# Altium project newUA_6.PrjPcb
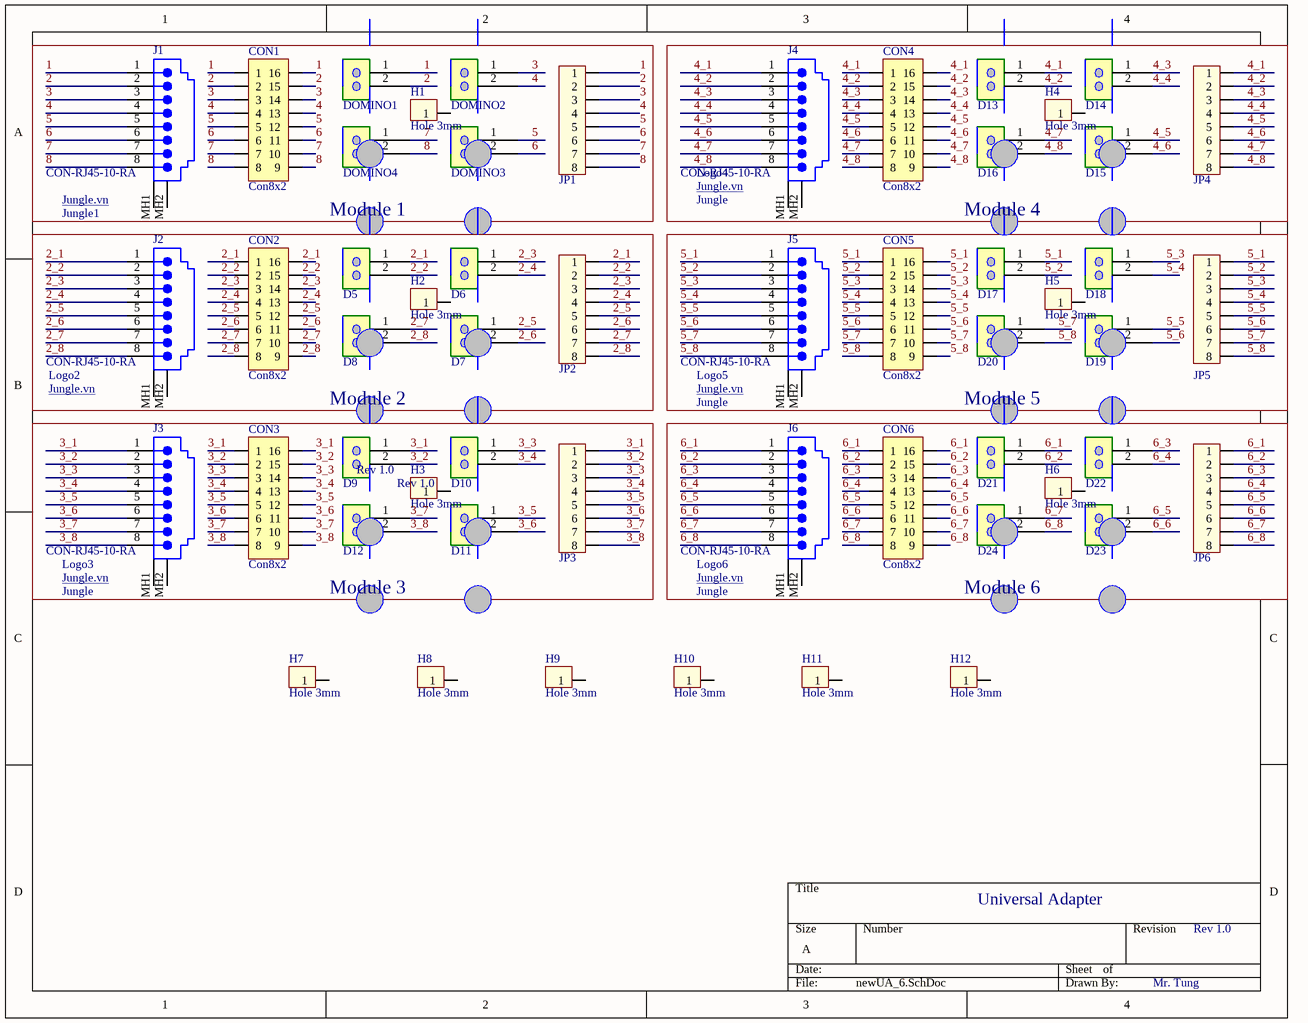
[diagram p0: newUA_6.SchDoc]
1 sheet, 60 parts. Net scope: global (net labels, ports and power ports of the same name join across sheets).
Board file: newUA_6.PcbDoc

## Sheet newUA_6.SchDoc: Universal Adapter
size A; DrawnBy: Mr. Tung; Revision: Rev 1.0

### Parts
CON1  Con8x2  [HEAD8x2]
CON2  Con8x2  [HEAD8x2]
CON3  Con8x2  [HEAD8x2]
CON4  Con8x2  [HEAD8x2]
CON5  Con8x2  [HEAD8x2]
CON6  Con8x2  [HEAD8x2]
D1  DOMINO1  [Domino2_small]
D2  DOMINO2  [Domino2_small]
D3  DOMINO3  [Domino2_small]
D4  DOMINO4  [Domino2_small]
D5  D5  [Domino2_small]
D6  D6  [Domino2_small]
D7  D7  [Domino2_small]
D8  D8  [Domino2_small]
D9  D9  [Domino2_small]
D10  D10  [Domino2_small]
D11  D11  [Domino2_small]
D12  D12  [Domino2_small]
D13  D13  [Domino2_small]
D14  D14  [Domino2_small]
D15  D15  [Domino2_small]
D16  D16  [Domino2_small]
D17  D17  [Domino2_small]
D18  D18  [Domino2_small]
D19  D19  [Domino2_small]
D20  D20  [Domino2_small]
D21  D21  [Domino2_small]
D22  D22  [Domino2_small]
D23  D23  [Domino2_small]
D24  D24  [Domino2_small]
H1  Hole 3mm  [Hole_3mm]
H2  Hole 3mm  [Hole_3mm]
H3  Hole 3mm  [Hole_3mm]
H4  Hole 3mm  [Hole_3mm]
H5  Hole 3mm  [Hole_3mm]
H6  Hole 3mm  [Hole_3mm]
H7  Hole 3mm  [Hole_3mm]
H8  Hole 3mm  [Hole_3mm]
H9  Hole 3mm  [Hole_3mm]
H10  Hole 3mm  [Hole_3mm]
H11  Hole 3mm  [Hole_3mm]
H12  Hole 3mm  [Hole_3mm]
J1  CON-RJ45-10-RA  [RJ45_tme]
J2  CON-RJ45-10-RA  [RJ45_tme]
J3  CON-RJ45-10-RA  [RJ45_tme]
J4  CON-RJ45-10-RA  [RJ45_tme]
J5  CON-RJ45-10-RA  [RJ45_tme]
J6  CON-RJ45-10-RA  [RJ45_tme]
JP1  JP8  [CON8mod]  (value not drawn)
JP2  JP8  [CON8mod]  (value not drawn)
JP3  JP8  [CON8mod]  (value not drawn)
JP4  JP8  [CON8mod]  (value not drawn)
JP5  JP8  [CON8mod]  (value not drawn)
JP6  JP8  [CON8mod]  (value not drawn)
Logo1  Jungle1  [Jungle]
Logo2  Jungle2  [Jungle]  (value not drawn)
Logo3  Jungle  [Jungle]
Logo4  Jungle  [Jungle]
Logo5  Jungle  [Jungle]
Logo6  Jungle  [Jungle]

### Blocks framed on the sheet
Module 1: CON1 D1-D4 H1 J1 JP1 Logo1
Module 4: CON4 D13-D16 H4 J4 JP4 Logo4
Module 2: CON2 D5-D8 H2 J2 JP2 Logo2
Module 3: CON3 D9-D12 H3 J3 JP3 Logo3

### Nets
1: CON1.1 CON1.16 D1.1 J1.1 JP1.1
2: CON1.2 CON1.15 D1.2 J1.2 JP1.2
2_1: CON2.1 CON2.16 D5.1 J2.1 JP2.1
2_2: CON2.2 CON2.15 D5.2 J2.2 JP2.2
2_3: CON2.3 CON2.14 D6.1 J2.3 JP2.3
2_4: CON2.4 CON2.13 D6.2 J2.4 JP2.4
2_5: CON2.5 CON2.12 D7.1 J2.5 JP2.5
2_6: CON2.6 CON2.11 D7.2 J2.6 JP2.6
2_7: CON2.7 CON2.10 D8.1 J2.7 JP2.7
2_8: CON2.8 CON2.9 D8.2 J2.8 JP2.8
3: CON1.3 CON1.14 D2.1 J1.3 JP1.3
3_1: CON3.1 CON3.16 D9.1 J3.1 JP3.1
3_2: CON3.2 CON3.15 D9.2 J3.2 JP3.2
3_3: CON3.3 CON3.14 D10.1 J3.3 JP3.3
3_4: CON3.4 CON3.13 D10.2 J3.4 JP3.4
3_5: CON3.5 CON3.12 D11.1 J3.5 JP3.5
3_6: CON3.6 CON3.11 D11.2 J3.6 JP3.6
3_7: CON3.7 CON3.10 D12.1 J3.7 JP3.7
3_8: CON3.8 CON3.9 D12.2 J3.8 JP3.8
4: CON1.4 CON1.13 D2.2 J1.4 JP1.4
4_1: CON4.1 CON4.16 D13.1 J4.1 JP4.1
4_2: CON4.2 CON4.15 D13.2 J4.2 JP4.2
4_3: CON4.3 CON4.14 D14.1 J4.3 JP4.3
4_4: CON4.4 CON4.13 D14.2 J4.4 JP4.4
4_5: CON4.5 CON4.12 D15.1 J4.5 JP4.5
4_6: CON4.6 CON4.11 D15.2 J4.6 JP4.6
4_7: CON4.7 CON4.10 D16.1 J4.7 JP4.7
4_8: CON4.8 CON4.9 D16.2 J4.8 JP4.8
5: CON1.5 CON1.12 D3.1 J1.5 JP1.5
5_1: CON5.1 CON5.16 D17.1 J5.1 JP5.1
5_2: CON5.2 CON5.15 D17.2 J5.2 JP5.2
5_3: CON5.3 CON5.14 D18.1 J5.3 JP5.3
5_4: CON5.4 CON5.13 D18.2 J5.4 JP5.4
5_5: CON5.5 CON5.12 D19.1 J5.5 JP5.5
5_6: CON5.6 CON5.11 D19.2 J5.6 JP5.6
5_7: CON5.7 CON5.10 D20.1 J5.7 JP5.7
5_8: CON5.8 CON5.9 D20.2 J5.8 JP5.8
6: CON1.6 CON1.11 D3.2 J1.6 JP1.6
6_1: CON6.1 CON6.16 D21.1 J6.1 JP6.1
6_2: CON6.2 CON6.15 D21.2 J6.2 JP6.2
6_3: CON6.3 CON6.14 D22.1 J6.3 JP6.3
6_4: CON6.4 CON6.13 D22.2 J6.4 JP6.4
6_5: CON6.5 CON6.12 D23.1 J6.5 JP6.5
6_6: CON6.6 CON6.11 D23.2 J6.6 JP6.6
6_7: CON6.7 CON6.10 D24.1 J6.7 JP6.7
6_8: CON6.8 CON6.9 D24.2 J6.8 JP6.8
7: CON1.7 CON1.10 D4.1 J1.7 JP1.7
8: CON1.8 CON1.9 D4.2 J1.8 JP1.8

Not connected (* = marked no-connect by the designer): H1 1; H2 1; H3 1; H4 1; H5 1; H6 1; H7 1; H8 1; H9 1; H10 1; H11 1; H12 1; J1 MH1(Shield) MH2(Shield); J2 MH1(Shield) MH2(Shield); J3 MH1(Shield) MH2(Shield); J4 MH1(Shield) MH2(Shield); J5 MH1(Shield) MH2(Shield); J6 MH1(Shield) MH2(Shield)

### Notes on the sheet
- Module 5
- Module 6
- (in symbol Jungle) Jungle.vn

### Library data of the parts
D1-D24 = Domino 2
H1-H12 = Hole_3mm
J1-J6 = CON-RJ45-10-RA: Right Angle, Standard Profile, External Shield PCB Jack
JP1-JP6 = Con8: Connector 8; Value: Connector 8
Logo1 Logo2 = Jungle